# Altium project ESP32DISPLAY.PrjPcb
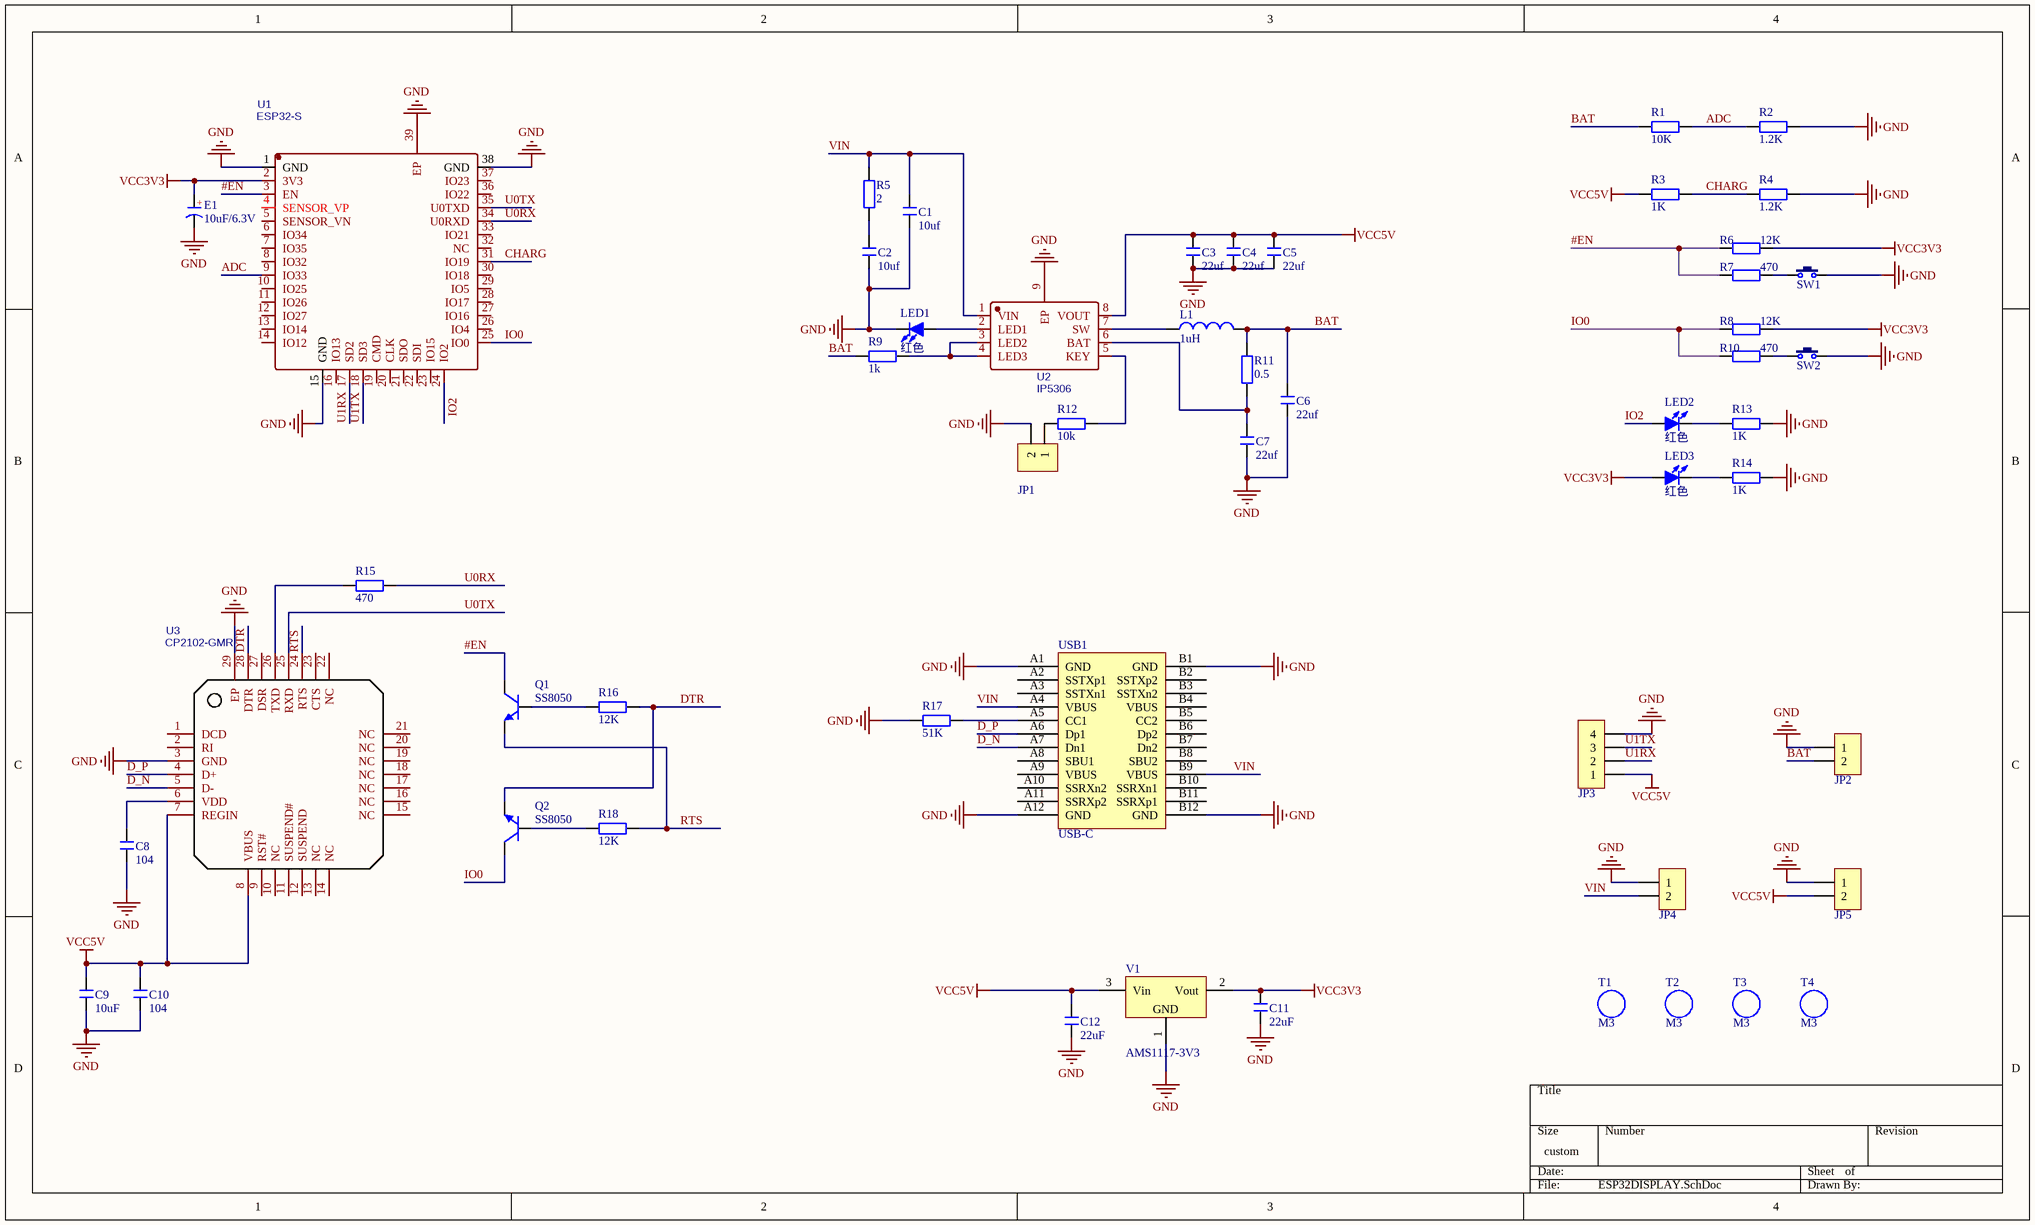
[diagram p0: ESP32DISPLAY.SchDoc]
1 sheet, 53 parts. Net scope: global (net labels, ports and power ports of the same name join across sheets).
Board file: ESP32DISPLAY.PcbDoc

## Sheet ESP32DISPLAY.SchDoc
size 381 x 228 mm

### Parts
C1  10uf  [C 1206]
C2  10uf  [C 1206]
C3  22uf  [C 1206]
C4  22uf  [C 1206]
C5  22uf  [C 1206]
C6  22uf  [C 1206]
C7  22uf  [C 1206]
C8  104  [C 0603_L]
C9  10uF  [C 1206_L]
C10  104  [C 0805_L]
C11  22uF  [C 1206_L]
C12  22uF  [C 1206_L]
E1  10uF/6.3V  [CD B(3528)]
JP1  HDR-1X2  [XH2.54-2P]  (value not drawn)
JP2  HDR-1X2  [XH2.54-2P]  (value not drawn)
JP3  HDR-1X4  [XH2.54-4P]  (value not drawn)
JP4  HDR-1X2  [XH2.54-2P]  (value not drawn)
JP5  HDR-1X2  [XH2.54-2P]  (value not drawn)
L1  1uH  [SMD,6.6x7.1x3.0mm]
LED1  红色  [LED 0603R]
LED2  红色  [LED 0603R]
LED3  红色  [LED 0603R]
Q1  SS8050  [SOT23-3N]
Q2  SS8050  [SOT23-3N]
R1  10K  [R 0603_L]
R2  1.2K  [R 0603_L]
R3  1K  [R 0603_L]
R4  1.2K  [R 0603_L]
R5  2  [R 0603]
R6  12K  [R 0603]
R7  470  [R 0603]
R8  12K  [R 0603]
R9  1k  [R 0603]
R10  470  [R 0603]
R11  0.5  [R 0603]
R12  10k  [R 0603]
R13  1K  [R 0603_L]
R14  1K  [R 0603_L]
R15  470  [R 0603_L]
R16  12K  [R 0603_L]
R17  51K  [R 0603]
R18  12K  [R 0603_L]
SW1  3x6x5  [TSW SMD-3*6*2.5]  (value not drawn)
SW2  3x6x5  [TSW SMD-3*6*2.5]  (value not drawn)
T1  M3  [M3 125X200]
T2  M3  [M3 125X200]
T3  M3  [M3 125X200]
T4  M3  [M3 125X200]
U1  ESP32-S  [ESP32-S]
U2  IP5306  [ESOP8]
U3  CP2102-GMR  [CP2102]
USB1  USB-C  [TYPE-C-31-M-12]
V1  AMS1117-3V3  [SOT223_N]

### Nets
GND: C1.1 C2.1 C3.1 C4.1 C5.1 C6.1 C7.1 C8.1 C9.1 C10.1 C11.1 C12.1 E1.2(K) JP1.2 JP2.1 JP3.4 JP4.1 JP5.1 LED1.2(K) R2.2 R4.2 R13.2 R14.2 R17.2 SW1.2 SW2.2 U1.1(GND) U1.15(GND) U1.38(GND) U1.39(EP) U2.9(EP) U3.3(GND) U3.29(EP) USB1.A1(GND) USB1.A12(GND) USB1.B1(GND) USB1.B12(GND) V1.1(GND)
VCC3V3: C11.2 E1.1(A) LED3.1(A) R6.1 R8.1 U1.2(3V3) V1.2(Vout)
VCC5V: C3.2 C4.2 C5.2 C9.2 C10.2 C12.2 JP3.1 JP5.2 R3.1 U2.8(VOUT) U3.7(REGIN) U3.8(VBUS) V1.3(Vin)
#EN: Q1.3(C) R6.2 R7.2 U1.3(EN)
ADC: R1.2 R2.1 U1.9(IO33)
BAT: C6.2 JP2.2 L1.2 R1.1 R9.2 R11.2
CHARG: R3.2 R4.1 U1.31(IO19)
D_N: U3.5(D-) USB1.A7(Dn1)
D_P: U3.4(D+) USB1.A6(Dp1)
DTR: Q2.2(E) R16.2 U3.28(DTR)
IO0: Q2.3(C) R8.2 R10.2 U1.25(IO0)
IO2: LED2.1(A) U1.24(IO2)
RTS: Q1.2(E) R18.2 U3.24(RTS)
U0RX: R15.2 U1.34(U0RXD)
U0TX: U1.35(U0TXD) U3.25(RXD)
U1RX: JP3.2 U1.17(SD2)
U1TX: JP3.3 U1.18(SD3)
VIN: C1.2 JP4.2 R5.1 U2.1(VIN) USB1.A4(VBUS) USB1.B9(VBUS)
NetC2_2: C2.2 R5.2
NetC7_2: C7.2 R11.1 U2.6(BAT)
NetC8_2: C8.2 U3.6(VDD)
NetJP1_1: JP1.1 R12.2
NetL1_1: L1.1 U2.7(SW)
NetLED1_1: LED1.1(A) U2.2(LED1)
NetLED2_2: LED2.2(K) R13.1
NetLED3_2: LED3.2(K) R14.1
NetQ1_1: Q1.1(B) R16.1
NetQ2_1: Q2.1(B) R18.1
NetR7_1: R7.1 SW1.1
NetR9_1: R9.1 U2.3(LED2) U2.4(LED3)
NetR10_1: R10.1 SW2.1
NetR12_1: R12.1 U2.5(KEY)
NetR15_1: R15.1 U3.26(TXD)
NetR17_1: R17.1 USB1.A5(CC1)

Not connected (* = marked no-connect by the designer): U1 4(SENSOR_VP) 5(SENSOR_VN) 6(IO34) 7(IO35) 8(IO32) 10(IO25) 11(IO26) 12(IO27) 13(IO14) 14(IO12) 16(IO13) 19(CMD) 20(CLK) 21(SDO) 22(SDI) 23(IO15) 26(IO4) 27(IO16) 28(IO17) 29(IO5) 30(IO18) 32(NC) 33(IO21) 36(IO22) 37(IO23); U3 1(DCD) 2(RI) 9(RST#) 10(NC) 11(SUSPEND#) 12(SUSPEND) 13(NC) 14(NC) 15(NC) 16(NC) 17(NC) 18(NC) 19(NC) 20(NC) 21(NC) 22(NC) 23(CTS) 27(DSR); USB1 A2(SSTXp1) A3(SSTXn1) A8(SBU1) A9(VBUS) A10(SSRXn2) A11(SSRXp2) B2(SSTXp2) B3(SSTXn2) B4(VBUS) B5(CC2) B6(Dp2) B7(Dn2) B8(SBU2) B10(SSRXn1) B11(SSRXp1)

### Notes on the sheet
- (in symbol C-CD) +

### Library data of the parts
C1-C7 = C: 无极性贴片电容; 版权归属: 源创客; BOM名称: 无极性贴片电容; 学习资源: www.ooocke.com
C8-C12 = C: 无极性贴片电容; 版权归属: 源创客; 材质: X7R; BOM名称: 无极性贴片电容; 学习资源: www.ooocke.com
E1 = C-CD: 贴片钽电容; 版权归属: 源创客; BOM名称: 贴片钽电容; 学习资源: www.ooocke.com
JP1 JP2 JP4 JP5 = Header 2: 2P接插件; 版权归属: 源创客; BOM名称: 2P接插件; 学习资源: www.ooocke.com
JP3 = Header 4: 4P接插件; 版权归属: 源创客; BOM名称: 4P接插件; 学习资源: www.ooocke.com
L1 = L: 小功率贴片电感; 版权归属: 源创客; BOM名称: 小功率贴片电感; 学习资源: www.ooocke.com
LED1-LED3 = LED-SMD: 贴片LED; 版权归属: 源创客; BOM名称: 贴片LED; 学习资源: www.ooocke.com
Q1 Q2 = 8050-SMD: 高频放大-NPN型; 版权归属: 源创客; 属性: 40V 1.5A 1W 100MHZ; BOM名称: 高频放大-NPN型; 学习资源: www.ooocke.com
R1-R18 = R: 贴片电阻; 版权归属: 源创客; BOM名称: 贴片电阻; 学习资源: www.ooocke.com
SW1 SW2 = TSW 3x6: 3x6轻触开关; 版权归属: 源创客; BOM名称: 3x6轻触开关; 学习资源: www.ooocke.com
T1-T4 = M3: 铜柱孔; 版权归属: 源创客; BOM名称: 铜柱孔; 学习资源: www.ooocke.com
U1 = ESP32-S: BOM_Manufacturer: Ai-Thinker; Contributor: LCSC; BOM_Paste Type: expand; BOM_Supplier: LCSC; BOM_Supplier Part: C277944; BOM_Manufacturer Part: ESP32-S; spicePre: U; spiceSymbolName: ESP32-S
U2 = IP5306: BOM_Manufacturer: INJOINIC; Contributor: LCSC; BOM_Paste Type: recommend; BOM_Supplier: LCSC; BOM_Supplier Part: C181692; BOM_Manufacturer Part: IP5306; spicePre: U; spiceSymbolName: IP5306
U3 = CP2102-GMR: BOM_Manufacturer: SILICON LABS; BOM_Paste Type: base; BOM_Supplier: LCSC; BOM_Manufacturer Part: CP2102-GMR; image: //image.lceda.cn/szlcsc/C6568.jpg; BOM_Supplier Part: C6568; spicePre: U; spiceSymbolName: CP2102-GMR
USB1 = USB-C/S: USB-C型母接口; 版权归属: 源创客; BOM名称: USB-C型母接口; 学习资源: www.ooocke.com
V1 = AMS1117: 三端稳压芯片; BOM名称: 稳压芯片; 版权归属: 源创客; 学习资源: www.ooocke.com